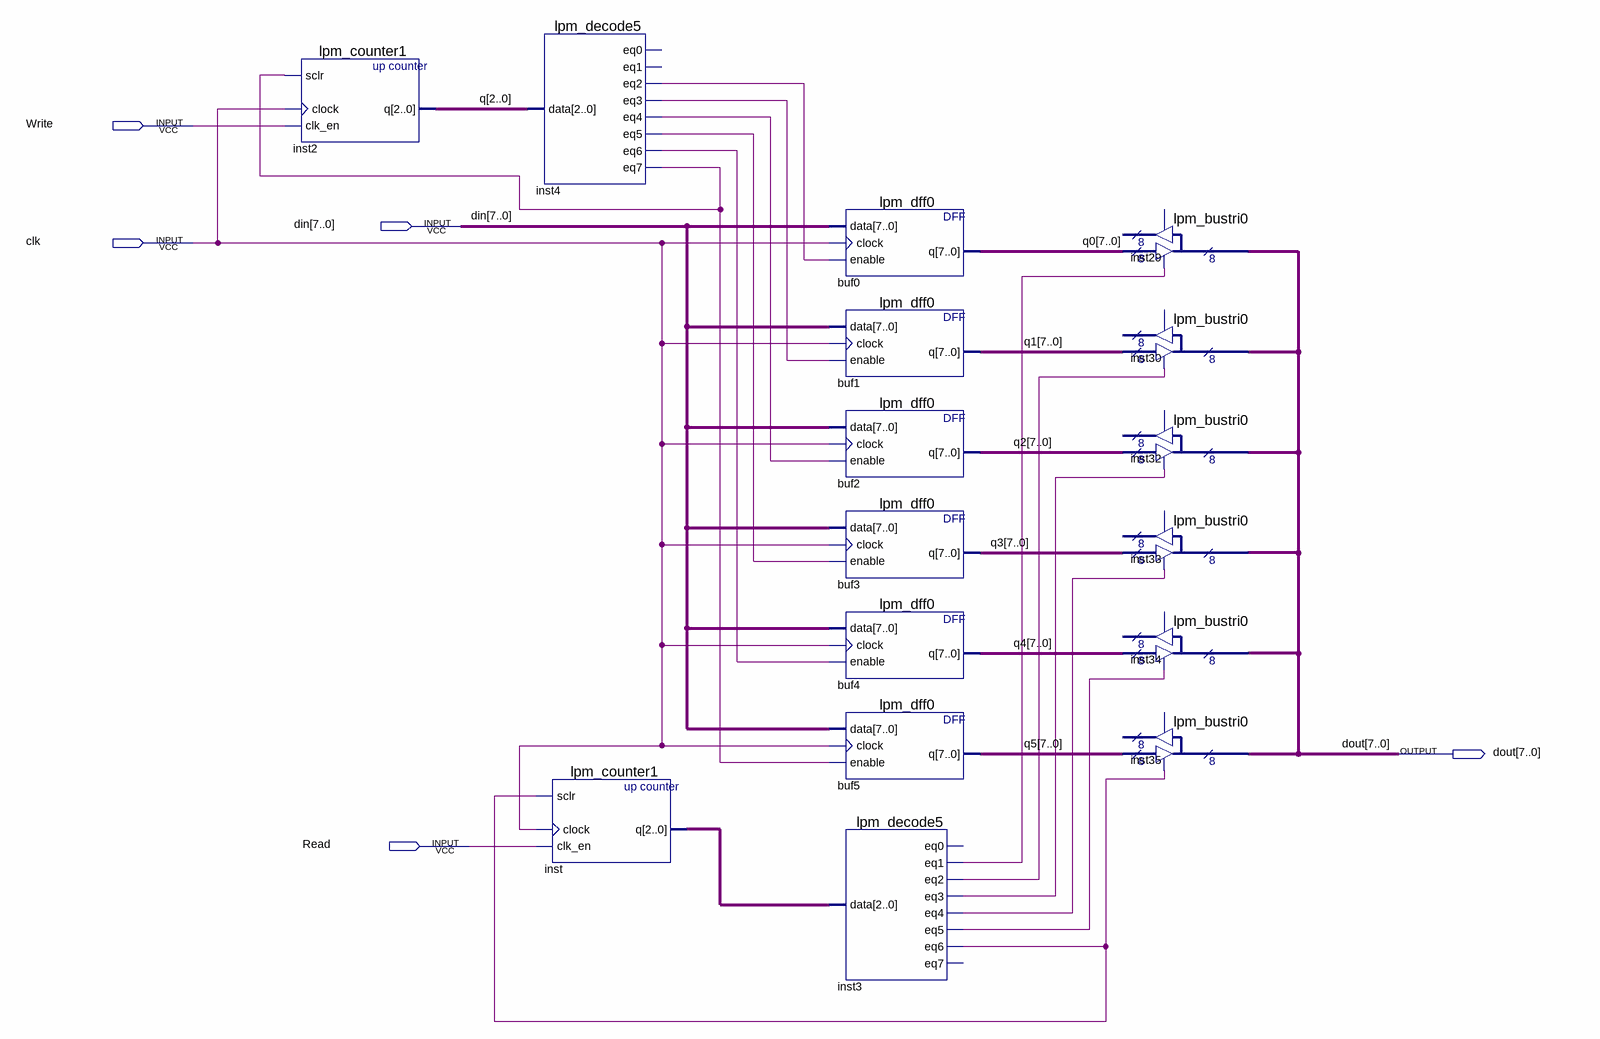
[diagram p0: schematic sheet]
// Quartus schematic Block1.bdf as structural Verilog: 16 symbols, 5 pins
module Block1 (
  input  Write,
  input  [7:0] din,
  input  clk,
  input  Read,
  output [7:0] dout
);

  wire inst3_eq1, inst3_eq2, inst3_eq3, inst3_eq4, inst3_eq5, inst3_eq6, inst4_eq2, inst4_eq3, inst4_eq4,
       inst4_eq5, inst4_eq6, inst4_eq7;
  wire [2:0] inst_q, q;
  wire [7:0] q0, q1, q2, q3, q4, q5;

  lpm_counter1 inst2 (.sclr(inst4_eq7), .clock(clk), .clk_en(Write), .q(q));
  lpm_decode5 inst4 (
    .data(q), .eq2(inst4_eq2), .eq3(inst4_eq3), .eq4(inst4_eq4), .eq5(inst4_eq5), .eq6(inst4_eq6),
    .eq7(inst4_eq7));  // open: eq0, eq1
  lpm_counter1 inst (.sclr(inst3_eq6), .clock(clk), .clk_en(Read), .q(inst_q));
  lpm_dff0 buf0 (.data(din), .clock(clk), .enable(inst4_eq2), .q(q0));
  lpm_dff0 buf1 (.data(din), .clock(clk), .enable(inst4_eq3), .q(q1));
  lpm_dff0 buf2 (.data(din), .clock(clk), .enable(inst4_eq4), .q(q2));
  lpm_dff0 buf3 (.data(din), .clock(clk), .enable(inst4_eq5), .q(q3));
  lpm_dff0 buf4 (.data(din), .clock(clk), .enable(inst4_eq6), .q(q4));
  lpm_dff0 buf5 (.data(din), .clock(clk), .enable(inst4_eq7), .q(q5));
  lpm_decode5 inst3 (
    .data(inst_q), .eq1(inst3_eq1), .eq2(inst3_eq2), .eq3(inst3_eq3), .eq4(inst3_eq4), .eq5(inst3_eq5),
    .eq6(inst3_eq6));  // open: eq0, eq7
  lpm_bustri0 inst29 (.enabledt(inst3_eq1), .data(q0), .tridata(dout));  // open: enabletr, result
  lpm_bustri0 inst30 (.enabledt(inst3_eq2), .data(q1), .tridata(dout));  // open: enabletr, result
  lpm_bustri0 inst32 (.enabledt(inst3_eq3), .data(q2), .tridata(dout));  // open: enabletr, result
  lpm_bustri0 inst33 (.enabledt(inst3_eq4), .data(q3), .tridata(dout));  // open: enabletr, result
  lpm_bustri0 inst34 (.enabledt(inst3_eq5), .data(q4), .tridata(dout));  // open: enabletr, result
  lpm_bustri0 inst35 (.enabledt(inst3_eq6), .data(q5), .tridata(dout));  // open: enabletr, result
endmodule
